# EAGLE design drums_01_1 (EAGLE 9.0.0)
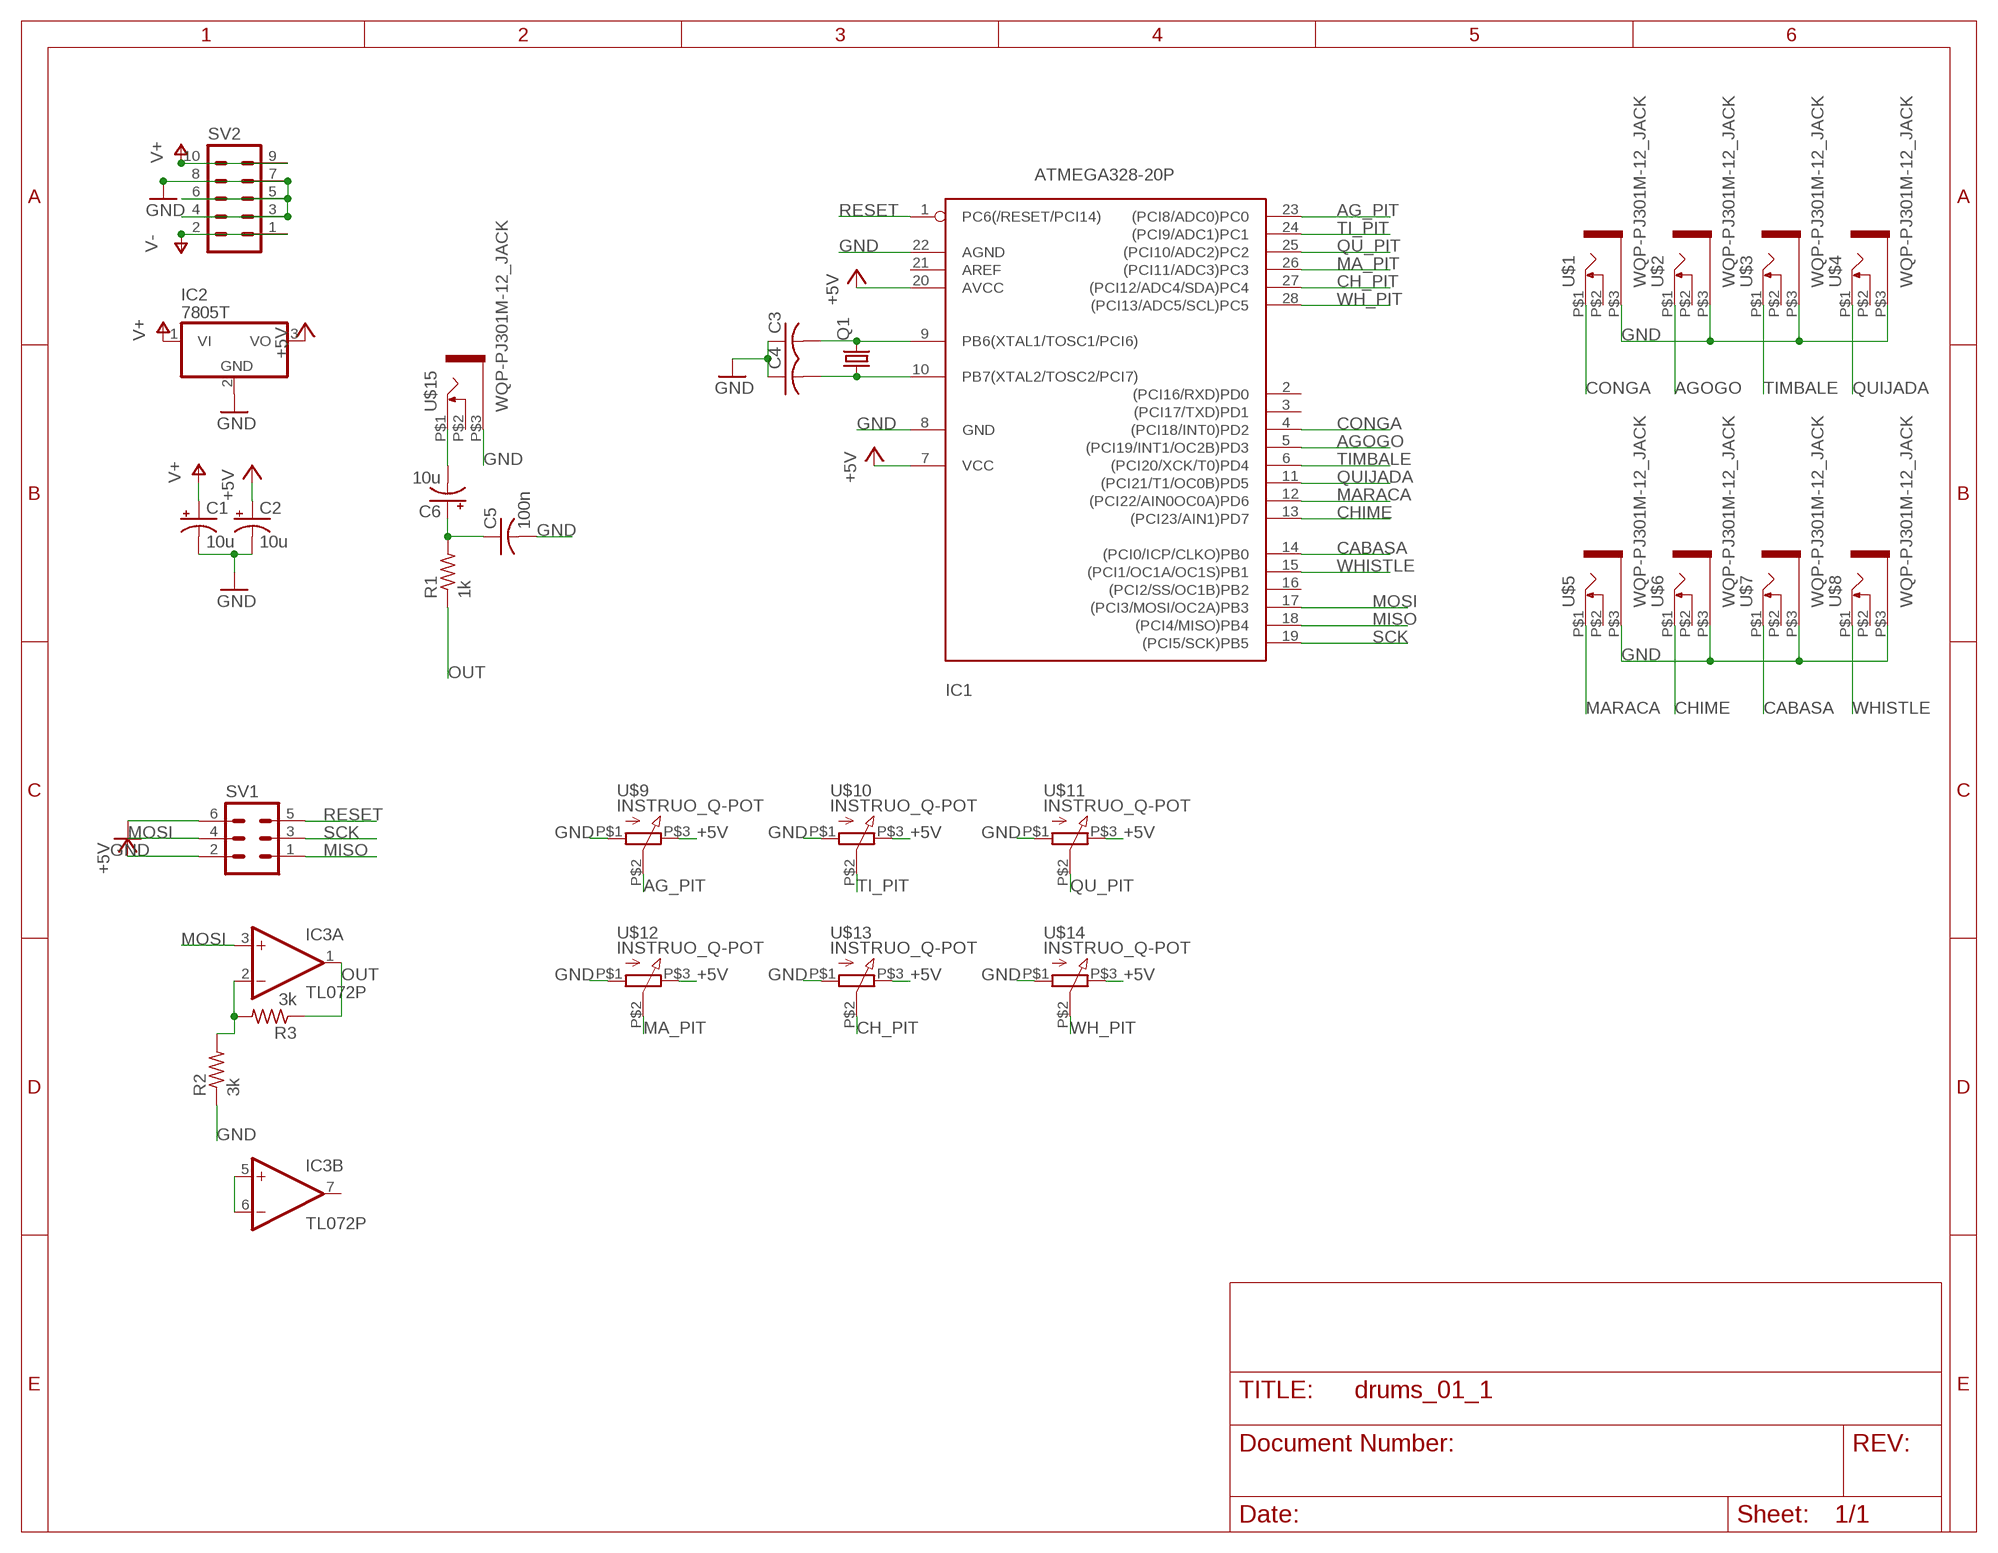
[diagram p0: schematic, sheet 1]

## Parts
C1  10u  CPOL-USE2.5-6  [E2,5-6]
C2  10u  CPOL-USE2.5-6  [E2,5-6]
C3  C-US025-024X044  [C025-024X044]
C4  C-US025-024X044  [C025-024X044]
C5  100n  C-US025-024X044  [C025-024X044]
C6  10u  CPOL-USE2.5-6  [E2,5-6]
IC1  ATMEGA328-20P  [DIL28-3]
IC2  7805T  [TO220H]
IC3  TL072P  [DIL08]
Q1  CRYSTALHC49U-V  [HC49U-V]
R1  1k  R-US_0207/12  [0207/12]
R2  3k  R-US_0207/12  [0207/12]
R3  3k  R-US_0207/12  [0207/12]
SV1  MA03-2  [MA03-2]
SV2  MA05-2  [MA05-2]
U$1  WQP-PJ301M-12_JACK  [WQP-PJ301M-12_JACK]
U$2  WQP-PJ301M-12_JACK  [WQP-PJ301M-12_JACK]
U$3  WQP-PJ301M-12_JACK  [WQP-PJ301M-12_JACK]
U$4  WQP-PJ301M-12_JACK  [WQP-PJ301M-12_JACK]
U$5  WQP-PJ301M-12_JACK  [WQP-PJ301M-12_JACK]
U$6  WQP-PJ301M-12_JACK  [WQP-PJ301M-12_JACK]
U$7  WQP-PJ301M-12_JACK  [WQP-PJ301M-12_JACK]
U$8  WQP-PJ301M-12_JACK  [WQP-PJ301M-12_JACK]
U$9  INSTRUO_Q-POT  [INSTRUO_Q-POT]
U$10  INSTRUO_Q-POT  [INSTRUO_Q-POT]
U$11  INSTRUO_Q-POT  [INSTRUO_Q-POT]
U$12  INSTRUO_Q-POT  [INSTRUO_Q-POT]
U$13  INSTRUO_Q-POT  [INSTRUO_Q-POT]
U$14  INSTRUO_Q-POT  [INSTRUO_Q-POT]
U$15  WQP-PJ301M-12_JACK  [WQP-PJ301M-12_JACK]

## Nets
+5V: C2.+ IC1.7(VCC) IC1.20(AVCC) IC2.3(VO) SV1.2 U$9.P$3 U$10.P$3 U$11.P$3 U$12.P$3 U$13.P$3 U$14.P$3
AG_PIT: IC1.23((PCI8/ADC0)PC0) U$9.P$2
AGOGO: IC1.5((PCI19/INT1/OC2B)PD3) U$2.P$1
CABASA: IC1.14((PCI0/ICP/CLKO)PB0) U$7.P$1
CH_PIT: IC1.27((PCI12/ADC4/SDA)PC4) U$13.P$2
CHIME: IC1.13((PCI23/AIN1)PD7) U$6.P$1
CONGA: IC1.4((PCI18/INT0)PD2) U$1.P$1
GND: C1.- C2.- C3.1 C4.1 C5.2 IC1.8(GND) IC1.22(AGND) IC2.2(GND) R2.1 SV1.6 SV2.3 SV2.4 SV2.5 SV2.6 SV2.7 SV2.8 U$1.P$3 U$2.P$3 U$3.P$3 U$4.P$3 U$5.P$3 U$6.P$3 U$7.P$3 U$8.P$3 U$9.P$1 U$10.P$1 U$11.P$1 U$12.P$1 U$13.P$1 U$14.P$1 U$15.P$3
MA_PIT: IC1.26((PCI11/ADC3)PC3) U$12.P$2
MARACA: IC1.12((PCI22/AIN0OC0A)PD6) U$5.P$1
MISO: IC1.18((PCI4/MISO)PB4) SV1.1
MOSI: IC1.17((PCI3/MOSI/OC2A)PB3) IC3.3(A:+IN) SV1.4
N$1: C3.2 IC1.9(PB6(XTAL1/TOSC1/PCI6)) Q1.2
N$2: C4.2 IC1.10(PB7(XTAL2/TOSC2/PCI7)) Q1.1
N$3: C6.- U$15.P$1
N$4: C5.1 C6.+ R1.2
N$5: IC3.5(B:+IN) IC3.6(B:-IN)
N$7: IC3.2(A:-IN) R2.2 R3.2
OUT: IC3.1(A:OUT) R1.1 R3.1
QU_PIT: IC1.25((PCI10/ADC2)PC2) U$11.P$2
QUIJADA: IC1.11((PCI21/T1/OC0B)PD5) U$4.P$1
RESET: IC1.1(PC6(/RESET/PCI14)) SV1.5
SCK: IC1.19((PCI5/SCK)PB5) SV1.3
TI_PIT: IC1.24((PCI9/ADC1)PC1) U$10.P$2
TIMBALE: IC1.6((PCI20/XCK/T0)PD4) U$3.P$1
V+: C1.+ IC2.1(VI) SV2.9 SV2.10
V-: SV2.1 SV2.2
WH_PIT: IC1.28((PCI13/ADC5/SCL)PC5) U$14.P$2
WHISTLE: IC1.15((PCI1/OC1A/OC1S)PB1) U$8.P$1
Unconnected: IC1.2((PCI16/RXD)PD0) IC1.3((PCI17/TXD)PD1) IC1.16((PCI2/SS/OC1B)PB2) IC1.21(AREF) IC3.7(B:OUT) U$1.P$2 U$2.P$2 U$3.P$2 U$4.P$2 U$5.P$2 U$6.P$2 U$7.P$2 U$8.P$2 U$15.P$2

## Power pins joined to a net without a drawn wire
V+: IC3.8(P:V+)
V-: IC3.4(P:V-)

## Library data of the parts
C1 C2 C6 = rcl:CPOL-US: POLARIZED CAPACITOR, American symbol; SPICEPREFIX: C
C3-C5 = rcl:C-US: CAPACITOR, American symbol; SPICEPREFIX: C
IC1 = atmega328:ATMEGA328*P: MICROCONTROLLER 32 kBytes FLASH 2 kBytes SRAM 1 kBytes EEPROM USART 8-channel 10 bit ADC
IC2 = linear:78*: Positive VOLTAGE REGULATOR Source: http://cache.national.com/ds/LM/LM78L05.pdf http://www.fairchildsemi.com/ds/LM/LM7805.pdf
IC3 = linear:TL072: OP AMP
Q1 = crystal:CRYSTAL: CRYSTAL; OC_FARNELL: 1666969; OC_NEWARK: unknown
R1-R3 = rcl:R-US_: RESISTOR, American symbol; SPICEPREFIX: R
SV1 = con-lstb:MA03-2: PIN HEADER; OC_FARNELL: unknown; OC_NEWARK: unknown
SV2 = con-lstb:MA05-2: PIN HEADER; OC_FARNELL: unknown; OC_NEWARK: unknown
U$1-U$8 U$15 = thonkiconn:WQP-PJ301M-12_JACK
U$9-U$14 = Pure_VCO_SMD_V2_2:INSTRUO_Q-POT

## Board
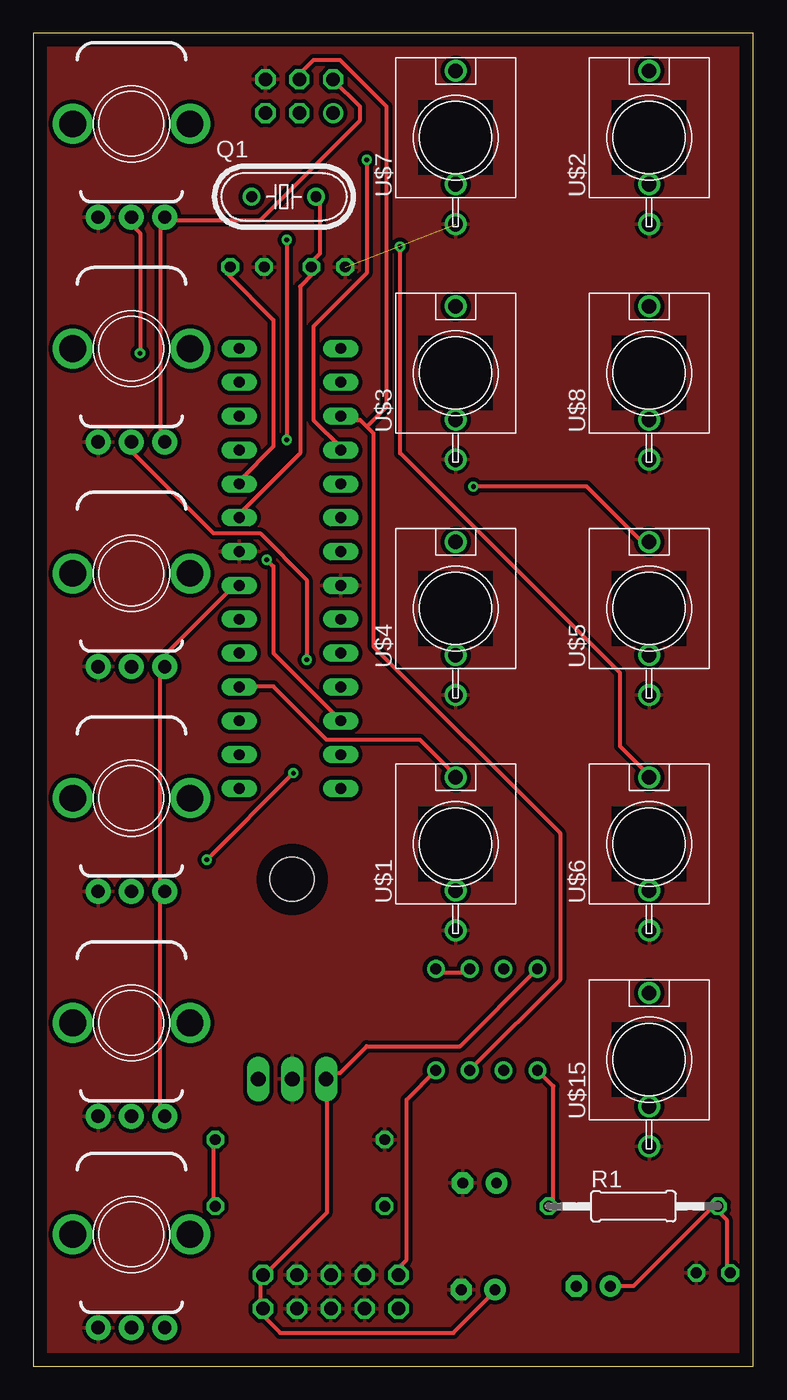
[diagram p1: board, top side]
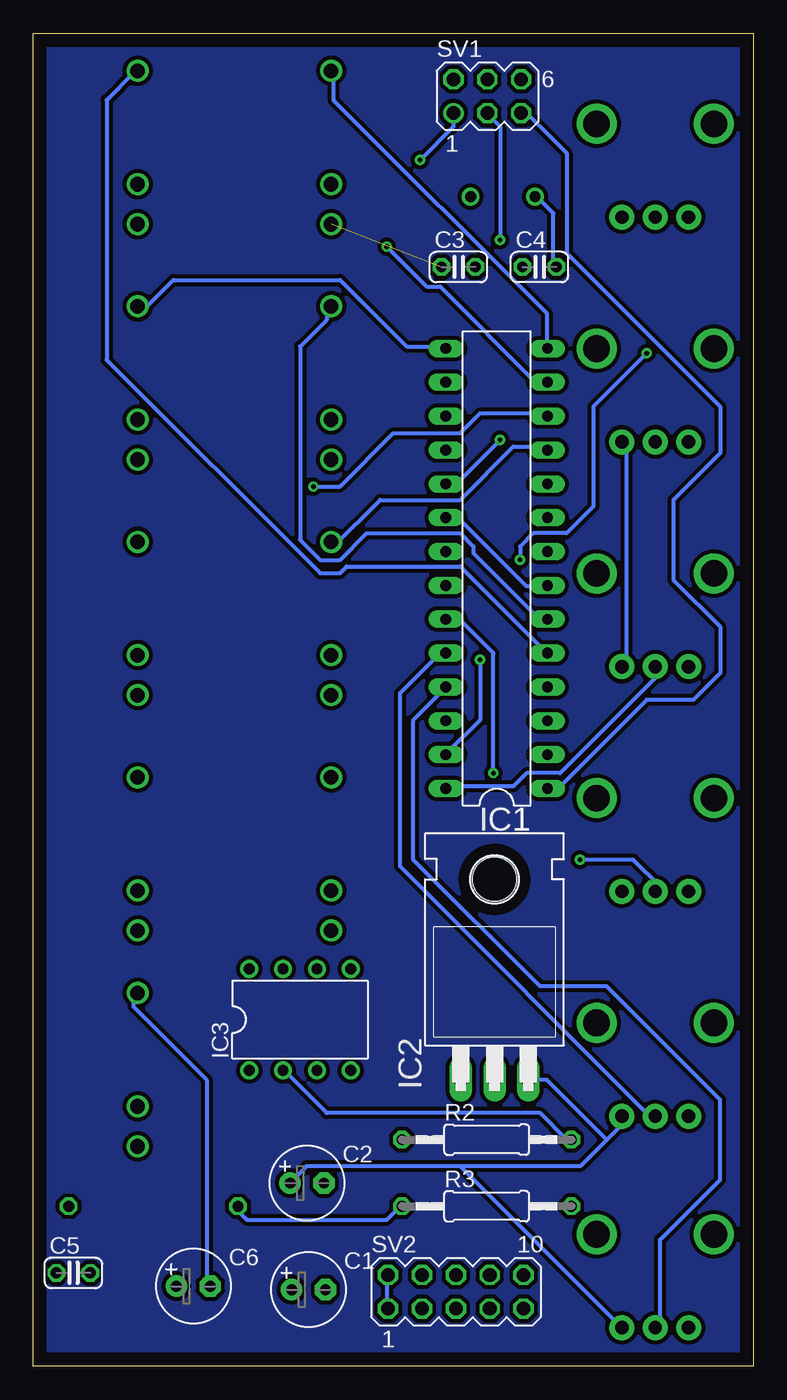
[diagram p2: board, bottom side, seen from below]

Size 54 x 100 mm. Coordinates in mm from the lower left corner, seen from the top.
Outline: 0,0 54,0 54,100 0,100 0,0
Copper layers (1*16): Top 0.035mm / dielectric 1.5mm / Bottom 0.035mm
Design rules "default *": minimum track width 12mil, minimum drill 0.35mm, track to track 12mil, track to pad 12mil, pad to pad 12mil, via to via 12mil, smd to smd 6mil, copper to edge 40mil, drill to drill 6mil, minimum pad ring 10mil, minimum via ring 8mil, stop-mask expansion 4mil, vias tented up to drill 0mil, thermal gap 10mil

### Footprints (pad centres in the part's own frame; a part is rotated, then mirrored left to right if it is on the bottom)
E2,5-6 = drill 0.813 pad 1.6: + -1.27,0 | drill 0.813 pad 1.6 octagon: - 1.27,0
C025-024X044 = drill 0.813 octagon: 1 -1.27,0; 2 1.27,0
DIL28-3 = drill 0.813 long: 1 -16.51,-3.81; 2 -13.97,-3.81; 3 -11.43,-3.81; 4 -8.89,-3.81; 5 -6.35,-3.81; 6 -3.81,-3.81; 7 -1.27,-3.81; 8 1.27,-3.81; 9 3.81,-3.81; 10 6.35,-3.81; 11 8.89,-3.81; 12 11.43,-3.81; 13 13.97,-3.81; 14 16.51,-3.81; 15 16.51,3.81; 16 13.97,3.81; 17 11.43,3.81; 18 8.89,3.81; 19 6.35,3.81; 20 3.81,3.81; 21 1.27,3.81; 22 -1.27,3.81; 23 -3.81,3.81; 24 -6.35,3.81; 25 -8.89,3.81; 26 -11.43,3.81; 27 -13.97,3.81; 28 -16.51,3.81
TO220H = drill 1.118 long: 1 -2.54,-10.16; 2 0,-10.16; 3 2.54,-10.16 | hole 3.302: 0,4.826
DIL08 = drill 0.813 pad 1.27: 1 -3.81,-3.81; 2 -1.27,-3.81; 3 1.27,-3.81; 4 3.81,-3.81; 5 3.81,3.81; 6 1.27,3.81; 7 -1.27,3.81; 8 -3.81,3.81
HC49U-V = drill 0.813: 1 -2.413,0; 2 2.413,0
0207/12 = drill 0.813 octagon: 1 -6.35,0; 2 6.35,0
MA03-2 = drill 1.016: 1 -2.54,-1.27 | drill 1.016 octagon: 2 -2.54,1.27; 3 0,-1.27; 4 0,1.27; 5 2.54,-1.27; 6 2.54,1.27
MA05-2 = drill 1.016 octagon: 1 -5.08,-1.27; 2 -5.08,1.27; 3 -2.54,-1.27; 4 -2.54,1.27; 5 0,-1.27; 6 0,1.27; 7 2.54,-1.27; 8 2.54,1.27; 9 5.08,-1.27; 10 5.08,1.27
WQP-PJ301M-12_JACK = drill 1.1: P$1 0,5; P$2 0,-3.5; P$3 0,-6.5
INSTRUO_Q-POT = drill 1 pad 1.88: P$1 -2.5,-7; P$2 0,-7; P$3 2.5,-7 | drill 2 pad 2.68: P$4 -4.4,0; P$5 4.4,0

### Placement (x,y rotation side)
C1  33.36,5.74 0 bottom
C2  33.47,13.74 0 bottom
C3  22.12,82.47 0 bottom
C4  16.04,82.47 0 bottom
C5  51,7 0 bottom
C6  42,6 0 bottom
IC1  19.25,59.85 90 bottom
IC2  19.41,31.7 0 bottom
IC3  34,26 0 bottom
Q1  18.79,87.74 0 top
R1  45,12 0 top
R2  20,17 0 bottom
R3  20,12 0 bottom
SV1  19.95,95.28 0 bottom
SV2  22.31,5.58 0 bottom
U$1  31.67,39.18 0 top
U$2  46.18,92.18 0 top
U$3  31.67,74.51 0 top
U$4  31.67,56.85 0 top
U$5  46.18,56.85 0 top
U$6  46.18,39.18 0 top
U$7  31.67,92.18 0 top
U$8  46.18,74.51 0 top
U$9  7.36,42.62 0 top
U$10  7.36,25.75 0 top
U$11  7.36,9.89 0 top
U$12  7.36,93.21 0 top
U$13  7.36,76.35 0 top
U$14  7.36,59.48 0 top
U$15  46.18,23 0 top

### Tracks (layer width: path | path; a pad name or v marks a point on that pad's centre or on a via)
+5V
  Top 0.305: SV1.2 22.5,96.5 24.5,94.5 24.5,93.5 17,86 10,86 U$12.P$3 9.5,86 9.5,69.5 U$13.P$3 | IC1.7 15,58.5 10,53.5 10,52.5 U$14.P$3 9.5,52 9.5,36 U$9.P$3 9.5,35.5 9.5,19 U$10.P$3
  Bottom 0.305: IC1.20 23,63.5 22,63.5 17,58.5 15.5,58.5 IC1.7 | 22,15 13,15 11,17 | 22,15 33.5,15 34.5,14 C2.+ | 11,17 9.5,18.5 U$10.P$3 | 11,17 15.5,21.5 16.5,21.5 IC2.3 | 22,15 10,3 U$11.P$3 | U$13.P$3 9.5,69 9.5,52.5 U$14.P$3
AG_PIT  (via drill 0.35)
  Top 0.305: v13,38 v19.5,44.5
  Bottom 0.305: v19.5,44.5 19.5,53.5 22,56 23,56 IC1.23 | v13,38 9,38 7,36 U$9.P$2
AGOGO
  Bottom 0.305: IC1.5 15.5,53.5 22,60 30.5,60 31,59.5 32.5,59.5 48.5,75.5 48.5,95 46.5,97 U$2.P$1
CABASA
  Bottom 0.305: IC1.14 15.5,76.5 15.5,79 31.5,95 31.5,97 U$7.P$1
CH_PIT  (via drill 0.35)
  Top 0.305: v20.5,53 20.5,59 17,62.5 13.5,62.5 7,69 U$13.P$2
  Bottom 0.305: v20.5,53 20.5,48.5 23,46 IC1.27
CHIME  (via drill 0.35)
  Top 0.305: v27.5,84 27.5,68.5 44,52 44,46.5 46,44.5 U$6.P$1
  Bottom 0.305: v27.5,84 24.5,81 23.5,81 16.5,74 15.5,74 IC1.13
CONGA
  Top 0.305: IC1.4 15.5,51 18,51 22,47 29,47 31.5,44.5 U$1.P$1
GND  (1 unrouted)
  pour Top: 0,100 54,100 54,0 0,0
MA_PIT  (via drill 0.35)
  Top 0.305: v17.5,60.5 18,60 18,53.5 23,48.5 IC1.26 | v8,76 8,85 7,86 U$12.P$2
  Bottom 0.305: v17.5,60.5 17.5,61.5 16.5,62.5 14,62.5 12,64.5 12,72 v8,76
MARACA  (via drill 0.35)
  Top 0.305: v33,66 41.5,66 46,61.5 U$5.P$1
  Bottom 0.305: v33,66 31,66 27,70 22,70 20.5,71.5 15.5,71.5 IC1.12
MISO  (via drill 0.35)
  Top 0.305: v25,90.5 25,82 21,78 21,71 23,69 IC1.18
  Bottom 0.305: v25,90.5 22.5,93 SV1.1
MOSI
  Top 0.305: 25,70.5 24.5,71 23.5,71 IC1.17 | 25,70.5 25.5,70 25.5,54 39.5,40 39.5,29 33,22.5 IC3.3 | 25,70.5 26.5,72 26.5,94.5 23,98 21,98 20,97 SV1.4
N$1
  Top 0.305: IC1.9 15.5,64 20,68.5 20,81 21,82 C3.2 20.5,82.5 21.5,83.5 21.5,87.5 Q1.2
N$2
  Top 0.305: IC1.10 15.5,66.5 18,69 18,78.5 14.5,82 C4.2
  Bottom 0.305: Q1.1 16,87.5 15,86.5 15,82.5 C4.2
N$3
  Bottom 0.305: C6.- 41,6 41,21.5 46.5,27 46.5,28 U$15.P$1
N$4
  Top 0.305: 51,12 52,11 52,7 C5.1 | C6.+ 45,6 51,12 | 51,12 R1.2
N$5
  Top 0.305: IC3.5 30.5,29.5 32.5,29.5 IC3.6
N$6
  pour Bottom: 0,100 54,100 54,0 0,0
N$7
  Top 0.305: R3.2 13.5,12 13.5,17 R2.2
  Bottom 0.305: IC3.2 35,22 32,19 16,19 14,17 R2.2
OUT
  Top 0.305: IC3.1 39,21 39,12 R1.1
  Bottom 0.305: R3.1 26.5,12 27.5,11 38,11 39,12 R1.1
QU_PIT
  Bottom 0.305: IC1.25 23.5,50.5 25.5,48.5 25.5,38 16,28.5 11,28.5 2.5,20 2.5,14 7,9.5 7,3 U$11.P$2
QUIJADA
  Bottom 0.305: IC1.11 15.5,69 18,69 22,65 28,65 31.5,61.5 U$4.P$1
RESET
  Bottom 0.305: IC1.1 15,43.5 14.5,43.5 8,50 4.5,50 2.5,52 2.5,55.5 6,59 6,65 2.5,68.5 2.5,72 14,83.5 14,91 17,94 SV1.5
SCK  (via drill 0.35)
  Top 0.305: v19,84.5 v19,69.5
  Bottom 0.305: v19,69.5 22,66.5 23,66.5 IC1.19 | v19,84.5 19,93 20,94 SV1.3
TI_PIT
  Bottom 0.305: IC1.24 23.5,53.5 26.5,50.5 26.5,37.5 7.5,18.5 U$10.P$2
TIMBALE
  Bottom 0.305: IC1.6 15.5,56.5 16.5,56.5 21,61 21,61.5 22,62.5 29,62.5 31,60.5 32.5,60.5 34,62 34,76.5 32,78.5 32,79.5 U$3.P$1
V+
  Top 0.305: C1.+ 34.5,5.5 31.5,2.5 18.5,2.5 17,4 SV2.9 17,4.5 17,6.5 SV2.10 17.5,7 22,11.5 22,21.5 IC2.1 22,22 23,22 25,24 32,24 IC3.8
V-
  Top 0.305: IC3.4 28,20 28,8 27,7 SV2.2
  Bottom 0.305: SV2.1 27.5,4.5 27.5,6.5 SV2.2
WH_PIT
  Bottom 0.305: IC1.28 23,43.5 18,43.5 17,44.5 14.5,44.5 7,52 U$14.P$2
WHISTLE
  Bottom 0.305: IC1.15 23.5,76.5 26,76.5 31,81.5 43.5,81.5 45.5,79.5 46,79.5 U$8.P$1